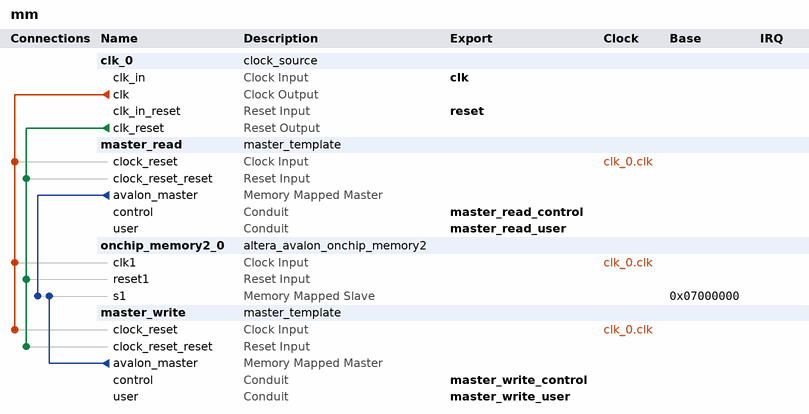
[diagram p0: system contents]
# Platform Designer (Qsys) system mm, Cyclone V 5CGXFC9D6F27C7
# Parameters at their usual value, and those the tool derives, are not listed.
package require -exact qsys 18.1
create_system mm
set_project_property DEVICE_FAMILY {Cyclone V}
set_project_property DEVICE 5CGXFC9D6F27C7

add_instance clk_0 clock_source 18.1
set_instance_parameter_value clk_0 clockFrequency 50000000

add_instance master_read master_template 1.0
set_instance_parameter_value master_read ADDRESS_WIDTH 32
set_instance_parameter_value master_read BURST_CAPABLE 0
set_instance_parameter_value master_read DATA_WIDTH 32
set_instance_parameter_value master_read FIFO_DEPTH 256
set_instance_parameter_value master_read MASTER_DIRECTION 0
set_instance_parameter_value master_read MAXIMUM_BURST_COUNT 2
set_instance_parameter_value master_read MEMORY_BASED_FIFO 1

add_instance onchip_memory2_0 altera_avalon_onchip_memory2 18.1
set_instance_parameter_value onchip_memory2_0 dataWidth 32
set_instance_parameter_value onchip_memory2_0 dualPort false
set_instance_parameter_value onchip_memory2_0 initMemContent true
set_instance_parameter_value onchip_memory2_0 initializationFileName /home/daniel/Working/OvS-DPDK-Coding-Switch/fpga/ip/pcie/MMTest/packets_in.hex
set_instance_parameter_value onchip_memory2_0 memorySize 1024
set_instance_parameter_value onchip_memory2_0 useNonDefaultInitFile true

add_instance master_write master_template 1.0
set_instance_parameter_value master_write ADDRESS_WIDTH 32
set_instance_parameter_value master_write BURST_CAPABLE 0
set_instance_parameter_value master_write DATA_WIDTH 32
set_instance_parameter_value master_write FIFO_DEPTH 256
set_instance_parameter_value master_write MASTER_DIRECTION 1
set_instance_parameter_value master_write MAXIMUM_BURST_COUNT 2
set_instance_parameter_value master_write MEMORY_BASED_FIFO 1

# connections
add_connection clk_0.clk master_read.clock_reset clock
add_connection clk_0.clk master_write.clock_reset clock
add_connection clk_0.clk onchip_memory2_0.clk1 clock
add_connection clk_0.clk_reset master_read.clock_reset_reset reset
add_connection clk_0.clk_reset master_write.clock_reset_reset reset
add_connection clk_0.clk_reset onchip_memory2_0.reset1 reset
add_connection master_read.avalon_master onchip_memory2_0.s1 avalon
set_connection_parameter_value master_read.avalon_master/onchip_memory2_0.s1 baseAddress 0x07000000
add_connection master_write.avalon_master onchip_memory2_0.s1 avalon
set_connection_parameter_value master_write.avalon_master/onchip_memory2_0.s1 baseAddress 0x07000000

# exported interfaces
add_interface clk clock sink
set_interface_property clk EXPORT_OF clk_0.clk_in
add_interface master_read_control conduit end
set_interface_property master_read_control EXPORT_OF master_read.control
add_interface master_read_user conduit end
set_interface_property master_read_user EXPORT_OF master_read.user
add_interface master_write_control conduit end
set_interface_property master_write_control EXPORT_OF master_write.control
add_interface master_write_user conduit end
set_interface_property master_write_user EXPORT_OF master_write.user
add_interface reset reset sink
set_interface_property reset EXPORT_OF clk_0.clk_in_reset

set_interconnect_requirement {$system} qsys_mm.clockCrossingAdapter HANDSHAKE
set_interconnect_requirement {$system} qsys_mm.enableEccProtection FALSE
set_interconnect_requirement {$system} qsys_mm.insertDefaultSlave FALSE
set_interconnect_requirement {$system} qsys_mm.maxAdditionalLatency 1

save_system mm.qsys
